# Altium schematic sheet PicoInterface.SchDoc
size 297 x 209 mm; SheetNumber: 1; SheetTotal: 5; swcgroup: Innovation and Research; Org: Sainsbury Wellcome Centre; Add1: 25 Howland Street; Add2: London; Add3: W1T 4JG; WebAddress: www.sainsburywellcome.org; SheetSize: A4; SheetName: Pi Pico Interface
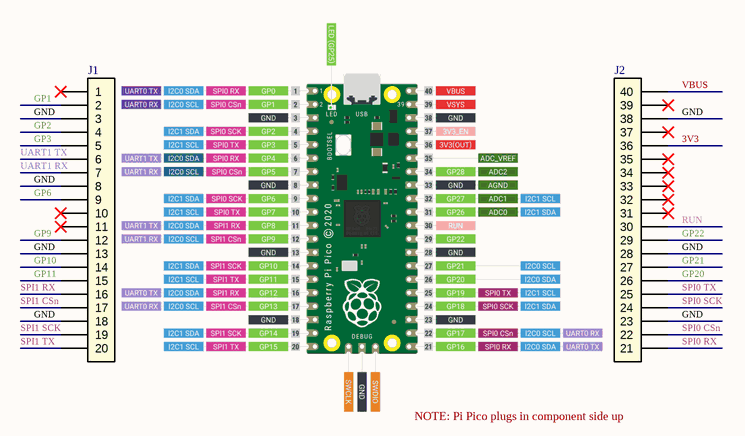
[diagram p0: PicoInterface.SchDoc]

## Parts
J1  SSW-120-01-x-S  [SAMTEC_SSW-120-01-G-S]  (value not drawn)
J2  SSW-120-01-x-S - 21-40  [SAMTEC_SSW-120-01-G-S - 21-40]  (value not drawn)

## Nets
3V3: J2.36
GND: J1.3 J1.8 J1.13 J1.18 J2.23 J2.28 J2.38
GP1: J1.2
GP2: J1.4
GP3: J1.5
GP6: J1.9
GP9: J1.12
GP10: J1.14
GP11: J1.15
GP20: J2.26
GP21: J2.27
GP22: J2.29
RUN: J2.30
SPI0 CSn: J2.22
SPI0 RX: J2.21
SPI0 SCK: J2.24
SPI0 TX: J2.25
SPI1 CSn: J1.17
SPI1 RX: J1.16
SPI1 SCK: J1.19
SPI1 TX: J1.20
UART1 RX: J1.7
UART1 TX: J1.6
VBUS: J2.40

Not connected (* = marked no-connect by the designer): J1 1* 10* 11*; J2 31* 32* 33* 34* 35* 37* 39*

## Notes on the sheet
- NOTE: Pi Pico plugs in component side up
- FILE
- VARIANT
- DATE
- REVISION
- SHEET
- /
- PROJECT
- SIZE

## Library data of the parts
J1 = CMP-310-0034-2: Conn Socket Strip SKT 20 POS 2.54mm Solder ST Thru-Hole; Gender: Female; Number of Contacts: 20; Mating Cycles: 100; Number of Rows: 1; Color: Black; RoHS Compliant: Yes; Contact Plating: Gold; Pitch: 2.54mm; Termination: Solder; Contact Material: Bronze; Mount: Through Hole
J2 = CMP-310-0035-1: Conn Socket Strip SKT 20 POS 2.54mm Solder ST Thru-Hole (pins 21 - 40); Gender: Female; Mating Cycles: 100; Number of Contacts: 20; Contact Material: Bronze; RoHS Compliant: Yes; Number of Rows: 1; Contact Plating: Gold; Mount: Through Hole; Pitch: 2.54mm; Termination: Solder; Color: Black